# Altium schematic sheet Amplifier.SchDoc
size A4; SheetNumber: 4; SheetTotal: 7
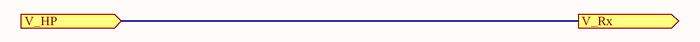
[diagram p0: Amplifier.SchDoc]

## Ports
V_HP (in), V_Rx (out)

## Nets
V_HP: port V_HP, port V_Rx